# Altium schematic sheet TB16_Control_Sch.SchDoc
size 594 x 420 mm; ListNumber: 1
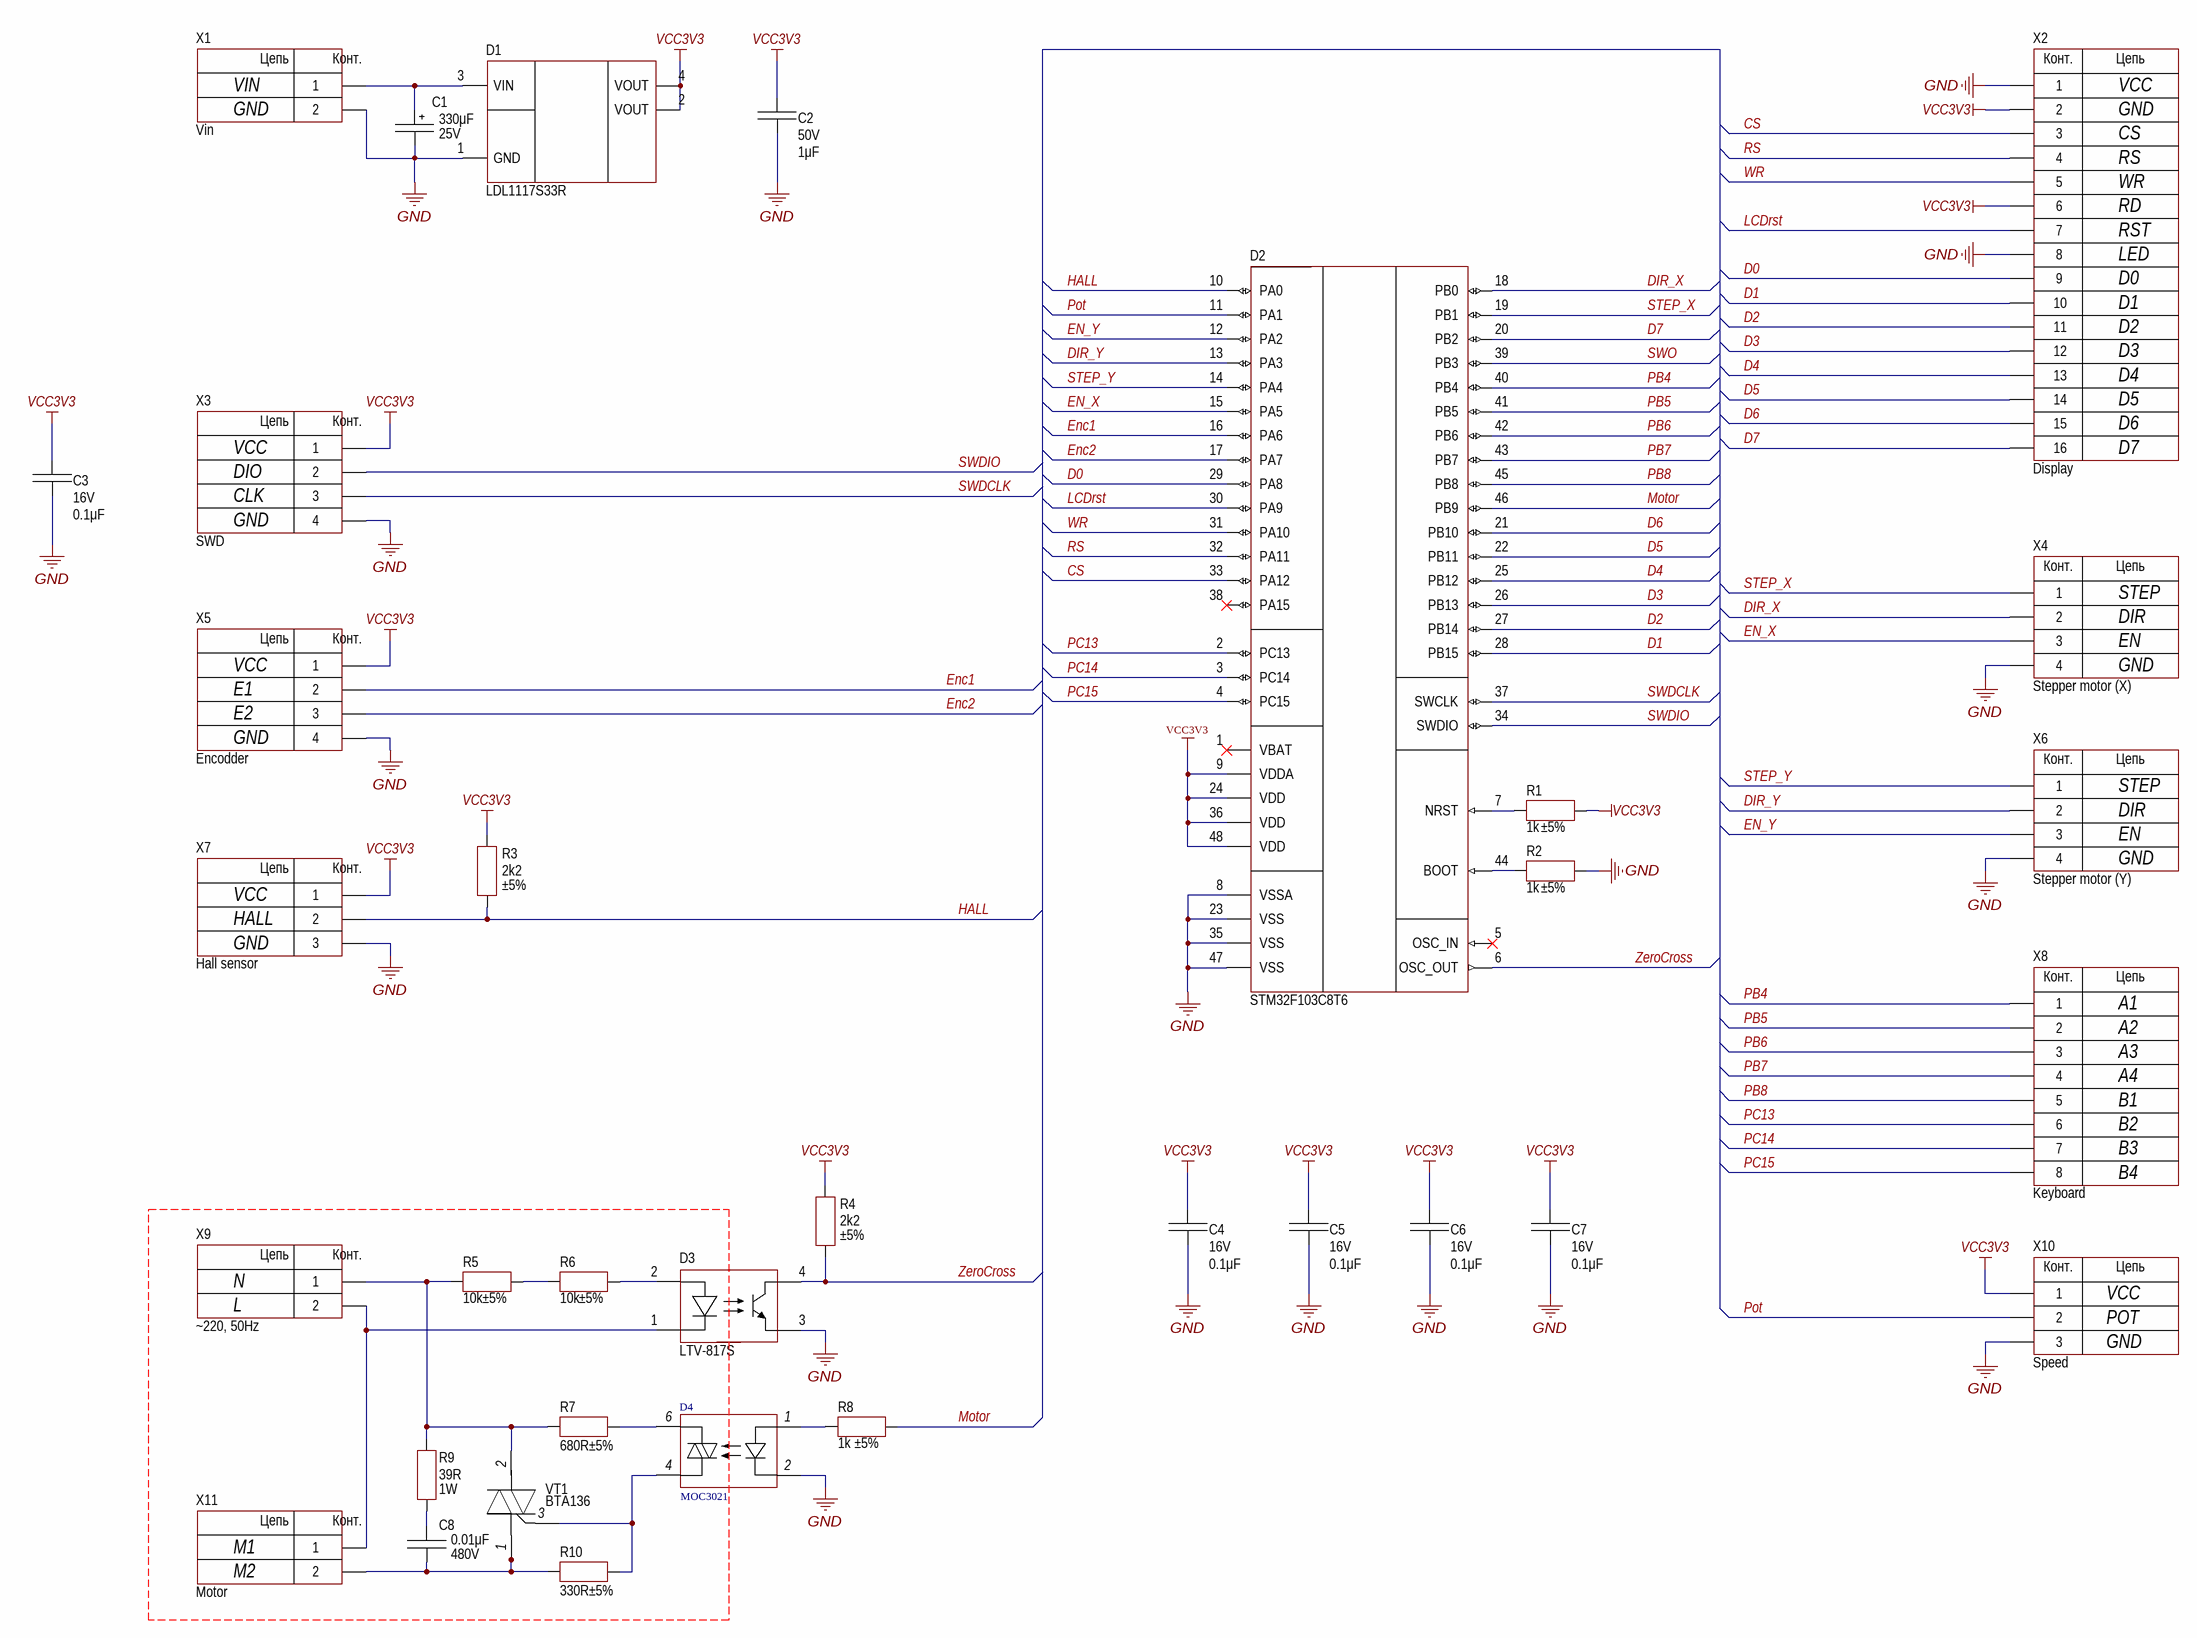
[diagram p0: TB16_Control_Sch.SchDoc]

## Parts
C1  value 330μF  Voltage: 25V  [CAP: D5C2H11]
C2  value 1μF  Voltage: 50V  [CAP: 1206]
C3  value 0.1μF  Voltage: 16V  [CAP: 0603]
C4  value 0.1μF  Voltage: 16V  [CAP: 0603]
C5  value 0.1μF  Voltage: 16V  [CAP: 0603]
C6  value 0.1μF  Voltage: 16V  [CAP: 0603]
C7  value 0.1μF  Voltage: 16V  [CAP: 0603]
C8  value 0.01μF  Voltage: 480V  [CAP: B32521]
D1  (no value)  [SOT223]
D2  (no value)  [48-LQFP]
D3  PartNumber: LTV-817S  [4-SMD]
D4  MOC3021  [SDIP-6]
R1  value 1k  Tolerance: ±5%  [RES: 0402]
R2  value 1k  Tolerance: ±5%  [RES: 0402]
R3  value 2k2  Tolerance: ±5%  [RES: 0402]
R4  value 2k2  Tolerance: ±5%  [RES: 0402]
R5  value 10k  Tolerance: ±5%  [RES: 1206]
R6  value 10k  Tolerance: ±5%  [RES: 1206]
R7  value 680R  Tolerance: ±5%  [RES: 1206]
R8  value 1k  Tolerance: ±5%  [RES: 0402]
R9  value 39R  Tolerance: 1W  [RES: 2512]
R10  value 330R  Tolerance: ±5%  [RES: 1206]
VT1  BTA136  [TO220]
X1  CommentText: Vin  [CON: PLS-2]
X2  CommentText: Display  [CON: PBS-16]
X3  CommentText: SWD  [CON: PLS-4]
X4  CommentText: Stepper motor (X)  [CON: PLS-4]
X5  CommentText: Encodder  [CON: PLS-4]
X6  CommentText: Stepper motor (Y)  [CON: PLS-4]
X7  CommentText: Hall sensor  [CON: PLS-3]
X8  CommentText: Keyboard  [CON: PLS-8]
X9  CommentText: ~220, 50Hz  [CON: 0395430002 (5 mm)]
X10  CommentText: Speed  [CON: PLS-3]
X11  CommentText: Motor  [CON: 0395430002 (5 mm)]

## Nets
GND: C1.2 C2.1 C3.1 C4.1 C5.1 C6.1 C7.1 D1.1(GND) D2.8(VSSA) D2.23(VSS) D2.35(VSS) D2.47(VSS) D3.3(E) D4.2(C) R2.1 X1.2 X2.1 X2.8 X3.4 X4.4 X5.4 X6.4 X7.3 X10.3
VCC3V3: C2.2 C3.2 C4.2 C5.2 C6.2 C7.2 D1.2(VOUT) D1.4(VOUT) D2.9(VDDA) D2.24(VDD) D2.36(VDD) D2.48(VDD) R1.1 R3.2 R4.2 X2.2 X2.6 X3.1 X5.1 X7.1 X10.1
CS: D2.33(PA12) X2.3
D0: D2.29(PA8) X2.9
D1: D2.28(PB15) X2.10
D2: D2.27(PB14) X2.11
D3: D2.26(PB13) X2.12
D4: D2.25(PB12) X2.13
D5: D2.22(PB11) X2.14
D6: D2.21(PB10) X2.15
D7: D2.20(PB2) X2.16
DIR_X: D2.18(PB0) X4.2
DIR_Y: D2.13(PA3) X6.2
EN_X: D2.15(PA5) X4.3
EN_Y: D2.12(PA2) X6.3
Enc1: D2.16(PA6) X5.2
Enc2: D2.17(PA7) X5.3
HALL: D2.10(PA0) R3.1 X7.2
LCDrst: D2.30(PA9) X2.7
Motor: D2.46(PB9) R8.2
PB4: D2.40(PB4) X8.1
PB5: D2.41(PB5) X8.2
PB6: D2.42(PB6) X8.3
PB7: D2.43(PB7) X8.4
PB8: D2.45(PB8) X8.5
PC13: D2.2(PC13) X8.6
PC14: D2.3(PC14) X8.7
PC15: D2.4(PC15) X8.8
Pot: D2.11(PA1) X10.2
RS: D2.32(PA11) X2.4
STEP_X: D2.19(PB1) X4.1
STEP_Y: D2.14(PA4) X6.1
SWDCLK: D2.37(SWCLK) X3.3
SWDIO: D2.34(SWDIO) X3.2
SWO: D2.39(PB3)
WR: D2.31(PA10) X2.5
ZeroCross: D2.6(OSC_OUT) D3.4(C) R4.1
NetC1_1: C1.1 D1.3(VIN) X1.1
NetC8_1: C8.1 R9.1
NetC8_2: C8.2 R10.1 VT1.1(T1) X11.1(2)
NetD2_7: D2.7(NRST) R1.2
NetD2_44: D2.44(BOOT) R2.2
NetD3_1: D3.1(C) X9.1(2) X11.2(1)
NetD3_2: D3.2(A) R6.2
NetD4_1: D4.1(A) R8.1
NetD4_4: D4.4(OUT2) R10.2 VT1.3(G)
NetD4_6: D4.6(OUT1) R7.2
NetR5_1: R5.1 R7.1 R9.2 VT1.2(T2) X9.2(1)
NetR5_2: R5.2 R6.1

Not connected (* = marked no-connect by the designer): D2 1(VBAT)* 5(OSC_IN)* 38(PA15)*

## Notes on the sheet
- VIN
- GND
- VCC
- CS
- RS
- WR
- RD
- RST
- LED
- D0
- D1
- D2
- D3
- D4
- D5
- D6
- DIO
- CLK
- D7
- STEP
- DIR
- E1
- EN
- E2
- HALL
- A1
- A2
- A3
- A4
- B1
- B2
- B3
- B4
- N
- L
- POT
- M1
- M2
- Перв. примен.
- Справ. №
- Подп. и дата
- Инв. № дубл.
- Взам. инв. №
- Изм.
- Лист
- № докум.
- Подп.
- Дата
- Лит.
- Масса
- Масштаб
- Разраб.
- Пров.
- Т. контр.
- Листов
- 1
- Инв. № подл.
- Н. контр.
- Утв.
- Копировал
- Формат А2
- (in symbol Connector_terminal_2pin) Цепь; Конт.
- (in symbol PBS-16) Конт.; Цепь
- (in symbol PLS-2) Цепь; Конт.
- (in symbol PLS-3) Цепь; Конт.
- (in symbol PLS-4) Цепь; Конт.
- (in symbol PLS-8) Конт.; Цепь

## Library data of the parts
C1 = Aluminium: Manufacturer: Wurth; PartNumber: 860080475013; ValueManufacturerPartNumber: Aluminium capacitor, 330μF, 25V, ±20%, 54mOhm, 14x10x5 mm, -55...+105°C; TypeCapacitor: Aluminium capacitor; Tolerance: ±20%; Impedance: 54mOhm; Package: 14x10x5 mm; HelpURL: https://www.digikey.com/product-detail/en/wurth-electronics-inc/860080475013/732-9029-1-ND/5728972; Temperature: -55...+105°C
C2 = Ceramic_1206: Manufacturer: Yageo; PartNumber: CC1206KRX7R9BB104; ValueManufacturerPartNumber: Ceramic capacitor, 1μF, X7R, ±10%, 50V, 1206, -55...+125°C; TypeCapacitor: Ceramic capacitor; Tolerance: ±10%; TypeDielectric: X7R; Package: 1206; HelpURL: https://www.digikey.com/product-detail/en/yageo/CC1206KRX7R9BB104/311-1179-1-ND/303089; Temperature: -55...+125°C
C3-C7 = Ceramic_0603: Manufacturer: Yageo; PartNumber: CC0603KRX7R7BB104; ValueManufacturerPartNumber: Ceramic capacitor, 0.1μF, X7R, ±10%, 16V, 0603, -55...+125°C; TypeCapacitor: Ceramic capacitor; Tolerance: ±10%; TypeDielectric: X7R; Package: 0603; HelpURL: https://www.digikey.com/product-detail/en/yageo/CC0603KRX7R7BB104/311-1088-1-ND/302998; Temperature: -55...+125°C
C8 = Film: Manufacturer: Epcos; PartNumber: B32774D4106K000; ValueManufacturerPartNumber: Film capacitor, 0.01μF, 480V, ±10%, 10.9mOhm, 31.5x15 mm, -40...+105°C; TypeCapacitor: Film capacitor; Tolerance: ±10%; Impedance: 10.9mOhm; Package: 31.5x15 mm; HelpURL: https://www.digikey.com/products/en/capacitors/film-capacitors/62?k=&pkeyword=&sv=0&pv2097=1958&sf=0&FV=fffc01ef%2C1f140000%2Cffe0003e%2Cffec6366&quantity=1&ColumnSort=1000011&page=1&stock=1&pageSize=25; Temperature: -40...+105°C
D1 = LDL1117S33R: Linear voltage regulator; Manufacturer: STMicroelectronics; ValueManufacturerPartNumber: Linear voltage regulator, input 3.9...18V, 0.6V, output 3.3V, 1.2A, -40...+85°C, SOT223; VoltageInput: input 3.9...18V; MaxDropout: 0.6V; CurrentOutput: 1.2A; VoltageOutput: output 3.3V; HelpURL: https://www.digikey.com/product-detail/en/stmicroelectronics/LDL1117S33R/497-17239-1-ND/7102079; Package: SOT223; ComponentType: Linear voltage regulator; Temperature: -40...+85°C; PartNumber: LDL1117S33R
D2 = STM32F103C8T6: Cortex-M3; Manufacturer: STMicroelectronics; ValueManufacturerPartNumber: IC microcontroller, 32-Bit, Cortex-M3, 72MHz, 64KB, 20KB, 2...3.6V, -40...+85°C, 48-LQFP; Supply: 2...3.6V; Speed: 72MHz; CoreSize: 32-Bit; MemoryROM: 64KB; MemoryRAM: 20KB; HelpURL: https://www.digikey.com/product-detail/en/stmicroelectronics/STM32F103C8T6TR/497-17666-1-ND/7804402; Package: 48-LQFP; ComponentType: IC microcontroller; Temperature: -40...+85°C; CoreProcessor: Cortex-M3; PartNumber: STM32F103C8T6
D3 = LTV-817: Optoisolator; Manufacturer: Lite-On; ValueManufacturerPartNumber: IC optoisolator, 4µs/3µs, 5000Vrms, 35V, -40...+125°C, 4-SMD; Supply: 35V; DataRate: 4µs/3µs; Isolation: 5000Vrms; HelpURL: https://www.digikey.com/product-detail/en/lite-on-inc/LTV-817S/160-1367-5-ND/385837; Package: 4-SMD; ComponentType: IC optoisolator; Temperature: -40...+125°C
D4 = MOC3021: Optotriac
R1 R2 R8 = Resistor_0402: Manufacturer: Yageo; PartNumber: RC0402JR-07100RL; ValueManufacturerPartNumber: Resistor film, 1k, ±5%, 0402, 0.063W, -55...+125°C; TypeResistor: Resistor film; Power: 0.063W; Package: 0402; HelpURL: https://www.digikey.com/product-detail/en/yageo/RC0402JR-07100RL/311-100JRCT-ND/729362; Temperature: -55...+125°C
R3 R4 = Resistor_0402: Manufacturer: Yageo; PartNumber: RC0402JR-07100RL; ValueManufacturerPartNumber: Resistor film, 2k2, ±5%, 0402, 0.063W, -55...+125°C; TypeResistor: Resistor film; Power: 0.063W; Package: 0402; HelpURL: https://www.digikey.com/product-detail/en/yageo/RC0402JR-07100RL/311-100JRCT-ND/729362; Temperature: -55...+125°C
R5 R6 = Resistor_1206: Manufacturer: Yageo; PartNumber: RC1206JR-07100RL; ValueManufacturerPartNumber: Resistor film, 10k, ±5%, 1206, 0.25W, -55...+125°C; TypeResistor: Resistor film; Power: 0.25W; Package: 1206; HelpURL: https://www.digikey.com/product-detail/en/yageo/RC1206JR-07100RL/311-100ERCT-ND/732153; Temperature: -55...+125°C
R7 = Resistor_1206: Manufacturer: Yageo; PartNumber: RC1206JR-07100RL; ValueManufacturerPartNumber: Resistor film, 680R, ±5%, 1206, 0.25W, -55...+125°C; TypeResistor: Resistor film; Power: 0.25W; Package: 1206; HelpURL: https://www.digikey.com/product-detail/en/yageo/RC1206JR-07100RL/311-100ERCT-ND/732153; Temperature: -55...+125°C
R9 = Resistor_2512: Manufacturer: Yageo; PartNumber: RC2512JK-07100RL; ValueManufacturerPartNumber: Resistor film, 39R, 1W, 2512, 1W, -55...+125°C; TypeResistor: Resistor film; Package: 2512; HelpURL: https://www.digikey.com/product-detail/en/yageo/RC2512JK-07100RL/YAG3393CT-ND/5962215; Temperature: -55...+125°C; Power: 1W
R10 = Resistor_1206: Manufacturer: Yageo; PartNumber: RC1206JR-07100RL; ValueManufacturerPartNumber: Resistor film, 330R, ±5%, 1206, 0.25W, -55...+125°C; TypeResistor: Resistor film; Power: 0.25W; Package: 1206; HelpURL: https://www.digikey.com/product-detail/en/yageo/RC1206JR-07100RL/311-100ERCT-ND/732153; Temperature: -55...+125°C
VT1 = BTA136: Triac
X1 = PLS-2: Manufacturer: Connfly; ValueManufacturerPartNumber: Connector, 2pin, 2.54mm, 500VAC, 3A; TypeConnector: Connector; VoltageMax: 500VAC; Pitch: 2.54mm; CurrentMax: 3A; Multichannel: 2pin; HelpURL: https://www.chipdip.ru/product/pls-2; PartNumber: PLS-2
X2 = PBS-16: Manufacturer: Connfly; ValueManufacturerPartNumber: Connector, 16pin, 2.54mm, 500VAC, 3A; TypeConnector: Connector; VoltageMax: 500VAC; Pitch: 2.54mm; CurrentMax: 3A; Multichannel: 16pin; HelpURL: https://www.chipdip.ru/product/pbs16; PartNumber: PBS-16
X3-X6 = PLS-4: Manufacturer: Connfly; ValueManufacturerPartNumber: Connector, 4pin, 2.54mm, 500VAC, 3A; TypeConnector: Connector; VoltageMax: 500VAC; Pitch: 2.54mm; CurrentMax: 3A; Multichannel: 4pin; HelpURL: https://www.chipdip.ru/product/pls-4; PartNumber: PLS-4
X7 X10 = PLS-3: Manufacturer: Connfly; ValueManufacturerPartNumber: Connector, 3pin, 2.54mm, 500VAC, 3A; TypeConnector: Connector; VoltageMax: 500VAC; Pitch: 2.54mm; CurrentMax: 3A; Multichannel: 3pin; HelpURL: https://www.chipdip.ru/product/pls-3; PartNumber: PLS-3
X8 = PLS-8: Manufacturer: Connfly; ValueManufacturerPartNumber: Connector, 8pin, 2.54mm, 500VAC, 3A; TypeConnector: Connector; VoltageMax: 500VAC; Pitch: 2.54mm; CurrentMax: 3A; Multichannel: 8pin; HelpURL: https://www.chipdip.ru/product/pls-8-ds1021-1-8sf112; PartNumber: PLS-8
X9 X11 = Connector_terminal_2pin: Manufacturer: Degson; ValueManufacturerPartNumber: Terminal connector, 2pin, 3.5mm, 300VAC, 10A; PartNumber: DG350-3.5-02P-14; TypeConnector: Terminal connector; VoltageMax: 300VAC; Pitch: 3.5mm; CurrentMax: 10A; Multichannel: 2pin; HelpURL: https://www.chipdip.ru/product/dg350-3.5-02p-12